# Altium schematic sheet DX-BT24-S-V1.1_SCH_Part_AD.SchDoc
size A4
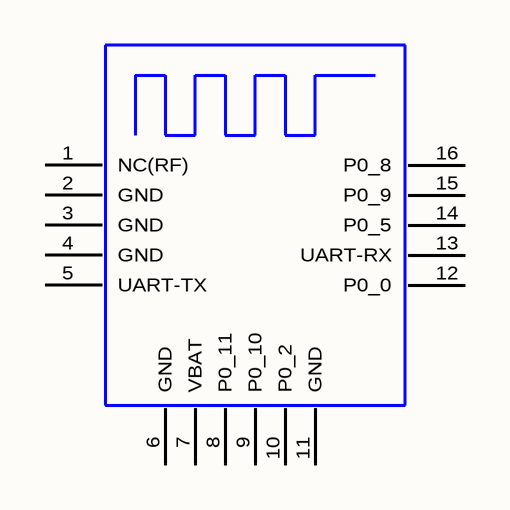
[diagram p0: DX-BT24-S-V1.1_SCH_Part_AD.SchDoc]

## Parts
U?  DX-BT24-S  [DX-BT24-S]  (value not drawn)

## Nets

Not connected (* = marked no-connect by the designer): U? 1(NC(RF)) 2(GND) 3(GND) 4(GND) 5(UART-TX) 6(GND) 7(VBAT) 8(P0_11) 9(P0_10) 10(P0_2) 11(GND) 12(P0_0) 13(UART-RX) 14(P0_5) 15(P0_9) 16(P0_8)

## Library data of the parts
U? = DX-BT24-S: PCB DECAL: DX-BT24-S